# Altium schematic sheet MCU.SchDoc
size B; SheetNumber: 2; SheetTotal: 8
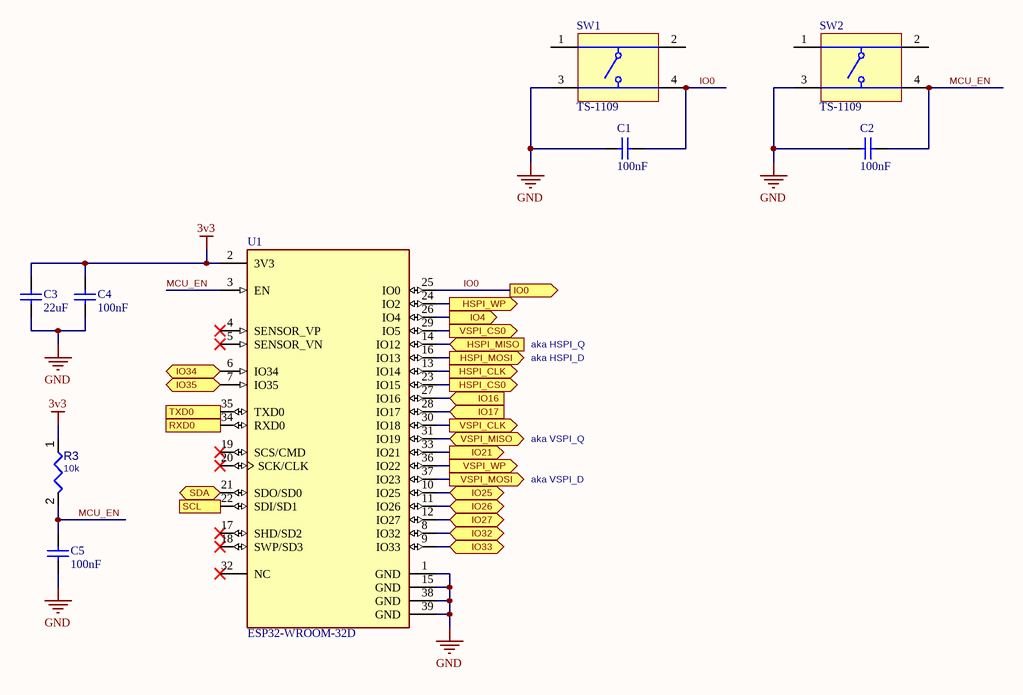
[diagram p0: MCU.SchDoc]

## Parts
C1  Capacitance: 100nF  [Capacitor_0402]  (hidden comment: GRM155R71E104KE14D)
C2  Capacitance: 100nF  [Capacitor_0402]  (hidden comment: GRM155R71E104KE14D)
C3  Capacitance: 22uF  [Capacitor_0603]  (hidden comment: GRM188R61A226ME15D)
C4  Capacitance: 100nF  [Capacitor_0402]  (hidden comment: GRM155R71E104KE14D)
C5  Capacitance: 100nF  [Capacitor_0402]  (hidden comment: GRM155R71E104KE14D)
R3  value 10k  [RESC0402(1005)_L]  (hidden comment: Resistor 10K  +/-1 % 0402 63 mW)
SW1  TS-1109  [BEST-TS-1109_V]
SW2  TS-1109  [BEST-TS-1109_V]
U1  ESP32-WROOM-32D  [ESP32-WROOM-32D-Footprint-1]

## Ports
HSPI_CLK (out), HSPI_CS0 (out), HSPI_MISO (in), HSPI_MOSI (out), HSPI_WP (out), IO0 (out), IO4 (out), IO16 (in), IO17 (in), IO21 (out), IO25 (bidir), IO26 (bidir), IO27 (bidir), IO32 (bidir), IO33 (bidir), IO34 (bidir), IO35 (bidir), RXD0 (in), SCL (out), SDA (bidir), TXD0 (out), VSPI_CLK (out), VSPI_CS0 (out), VSPI_MISO (bidir), VSPI_MOSI (out), VSPI_WP (out)

## Nets
3v3: C3.2 C4.2 R3.1 U1.2(3V3)
GND: C1.2 C2.2 C3.1 C4.1 C5.1 SW1.3 SW2.3 U1.1(GND) U1.15(GND) U1.38(GND) U1.39(GND)
HSPI_CLK: U1.13(IO14) ; port HSPI_CLK
HSPI_CS0: U1.23(IO15) ; port HSPI_CS0
HSPI_MISO: U1.14(IO12) ; port HSPI_MISO
HSPI_MOSI: U1.16(IO13) ; port HSPI_MOSI
HSPI_WP: U1.24(IO2) ; port HSPI_WP
IO0: C1.1 SW1.4 U1.25(IO0) ; port IO0
IO4: U1.26(IO4) ; port IO4
IO16: U1.27(IO16) ; port IO16
IO17: U1.28(IO17) ; port IO17
IO21: U1.33(IO21) ; port IO21
IO25: U1.10(IO25) ; port IO25
IO26: U1.11(IO26) ; port IO26
IO27: U1.12(IO27) ; port IO27
IO32: U1.8(IO32) ; port IO32
IO33: U1.9(IO33) ; port IO33
IO34: U1.6(IO34) ; port IO34
IO35: U1.7(IO35) ; port IO35
MCU_EN: C2.1 C5.2 R3.2 SW2.4 U1.3(EN)
RXD0: U1.34(RXD0) ; port RXD0
SCL: U1.22(SDI/SD1) ; port SCL
SDA: U1.21(SDO/SD0) ; port SDA
TXD0: U1.35(TXD0) ; port TXD0
VSPI_CLK: U1.30(IO18) ; port VSPI_CLK
VSPI_CS0: U1.29(IO5) ; port VSPI_CS0
VSPI_MISO: U1.31(IO19) ; port VSPI_MISO
VSPI_MOSI: U1.37(IO23) ; port VSPI_MOSI
VSPI_WP: U1.36(IO22) ; port VSPI_WP

Not connected (* = marked no-connect by the designer): SW1 1 2; SW2 1 2; U1 4(SENSOR_VP)* 5(SENSOR_VN)* 17(SHD/SD2)* 18(SWP/SD3)* 19(SCS/CMD)* 20(SCK/CLK)* 32(NC)*

## Notes on the sheet
- aka HSPI_Q
- aka HSPI_D
- aka VSPI_Q
- aka VSPI_D

## Library data of the parts
C1 C2 C4 C5 = CMP-001-00084-3: Chip Capacitor 100nF 0402 25V X7R
C3 = CMP-001-00083-1: 0603 22 uF 10 V ±20% Tolerance X5R Multilayer Ceramic Chip Capacitor; Tolerance: 20%
R3 = CMP-009-00149-2: Chip Resistor, 10 kOhms, +/-1 %, 63 mW, -55 to 125 degC, 0402; Power: 63mW; Tolerance: 1%; Pins: 2; Max Operating Temperature: 155°C; Min Operating Temperature: -55°C; Case/Package: 0402
SW1 SW2 = CMP-011-00002-1: Tactile Switch, SPST, 12 V, 50 mA, -20 to 80 degC, 4-Pin THD; Manufacturer: Shenzhen Best; Case/Package: TS-1109; Mounting Technology: TH; Package Description: 4-Pin Through Hole Device, Body 6.2 x 6.2 mm; Manufacturer URL: www.best-dz.com/; RoHS Compliant: Unknown; Datasheet Version: Dec-12; Datasheet URL: http://datasheet.octopart.com/TS-1109-Best-Inc.-datasheet-30458100.pdf; Package Reference: TS-1109
U1 = CMP-020-00023-1: Bluetooth, WiFi 802.11b/g/n, Bluetooth v4.2 + EDR, Class 1, 2 and 3 Transceiver Module 2.4GHz ~ 2.5GHz Integrated, Trace Surface Mount